# EAGLE design ssm (EAGLE 8.3.1)
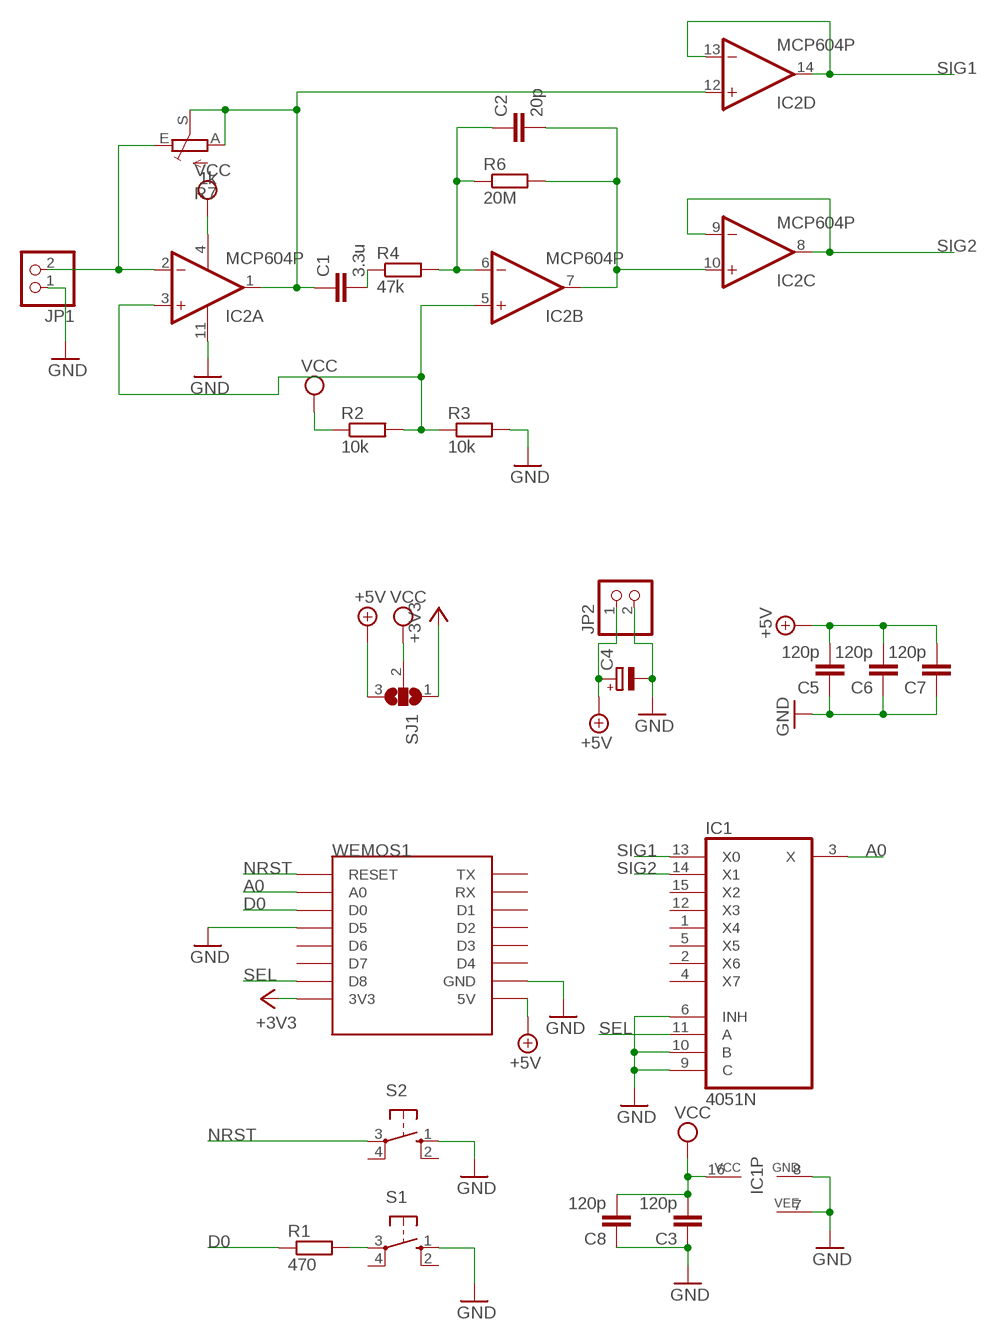
[diagram p0: schematic, sheet 1]

## Parts
C1  3.3u  C-EU  [C225-087X210]
C2  20p  C-EU025-024X044  [C025-024X044]
C3  120p  C-EU025-024X044  [C025-024X044]
C4  CPOL-EUE2.5-5  [E2,5-5]
C5  120p  C-EU025-024X044  [C025-024X044]
C6  120p  C-EU025-024X044  [C025-024X044]
C7  120p  C-EU025-024X044  [C025-024X044]
C8  120p  C-EU025-024X044  [C025-024X044]
IC1  4051N  [DIL16]
IC2  MCP604P  [DIL14]
JP1  PINHD-1X2  [1X02]
JP2  PINHD-1X2  [1X02]
R1  470  R-EU_0204/7  [0204/7]
R2  10k  R-EU_0204/7  [0204/7]
R3  10k  R-EU_0204/7  [0204/7]
R4  47k  R-EU_0204/7  [0204/7]
R6  20M  R-EU_0207/10  [0207/10]
R7  1k  TRIM_EU-B64Y  [B64Y]
S1  10-XX  [B3F-10XX]
S2  10-XX  [B3F-10XX]
SJ1  SJ2W  [SJ_2]
WEMOS1  WEMOS-D1-MINI  [WEMOS-D1-MINI]

## Nets
+3V3: SJ1.1 WEMOS1.3V3
+5V: C4.+ C5.2 C6.2 C7.2 JP2.1 SJ1.3 WEMOS1.5V
A0: IC1.3(X) WEMOS1.A0
D0: R1.1 WEMOS1.D0
GND: C3.1 C4.- C5.1 C6.1 C7.1 C8.1 IC1.6(INH) IC1.7(VEE) IC1.8(GND) IC1.9(C) IC1.10(B) IC2.11(P:V-) JP1.1 JP2.2 R3.2 S1.1(S) S2.1(S) WEMOS1.D5 WEMOS1.GND
N$2: IC2.2(A:-IN) JP1.2 R7.E
N$3: R1.2 S1.3(P)
N$4: IC2.3(A:+IN) IC2.5(B:+IN) R2.2 R3.1
N$5: C1.1 IC2.1(A:OUT) IC2.12(D:+IN) R7.A R7.S
N$6: C1.2 R4.1
N$7: C2.1 IC2.6(B:-IN) R4.2 R6.1
N$8: C2.2 IC2.7(B:OUT) IC2.10(C:+IN) R6.2
NRST: S2.3(P) WEMOS1.RESET
SEL: IC1.11(A) WEMOS1.D8
SIG1: IC1.13(X0) IC2.13(D:-IN) IC2.14(D:OUT)
SIG2: IC1.14(X1) IC2.8(C:OUT) IC2.9(C:-IN)
VCC: C3.2 C8.2 IC1.16(VCC) IC2.4(P:V+) R2.1 SJ1.2
Unconnected: IC1.1(X4) IC1.2(X6) IC1.4(X7) IC1.5(X5) IC1.12(X3) IC1.15(X2) S1.2(S1) S1.4(P1) S2.2(S1) S2.4(P1) WEMOS1.D1 WEMOS1.D2 WEMOS1.D3 WEMOS1.D4 WEMOS1.D6 WEMOS1.D7 WEMOS1.RX WEMOS1.TX

## Library data of the parts
C1 = Cap:C-EU: CAPACITOR, European symbol
C2 C3 C5-C8 = rcl:C-EU: CAPACITOR, European symbol
C4 = rcl:CPOL-EU: POLARIZED CAPACITOR, European symbol
IC1 = 40xx:4051: 8-channel ANALOG MULTIPLEXER
IC2 = linear:MCP604: Quad Op Amp 2.7V to 6.0V Single Supply CMOS Source: http://ww1.microchip.com/downloads/en/DeviceDoc/21314g.pdf
JP1 JP2 = pinhead:PINHD-1X2: PIN HEADER
R1-R4 = resistor:R-EU_: RESISTOR, European symbol
R6 = rcl:R-EU_: RESISTOR, European symbol
R7 = pot:TRIM_EU-: POTENTIOMETER
S1 S2 = switch-omron:10-XX: OMRON SWITCH; MPN: B3F-1000; OC_FARNELL: 176432; OC_NEWARK: 36M3542
SJ1 = jumper:SJ2W: SMD solder JUMPER
WEMOS1 = esp8266modules:WEMOS-D1-MINI: WeMos.cc D1 mini ESP8266 module

## Net classes
0 default: clearance 0.205 mm

## Board
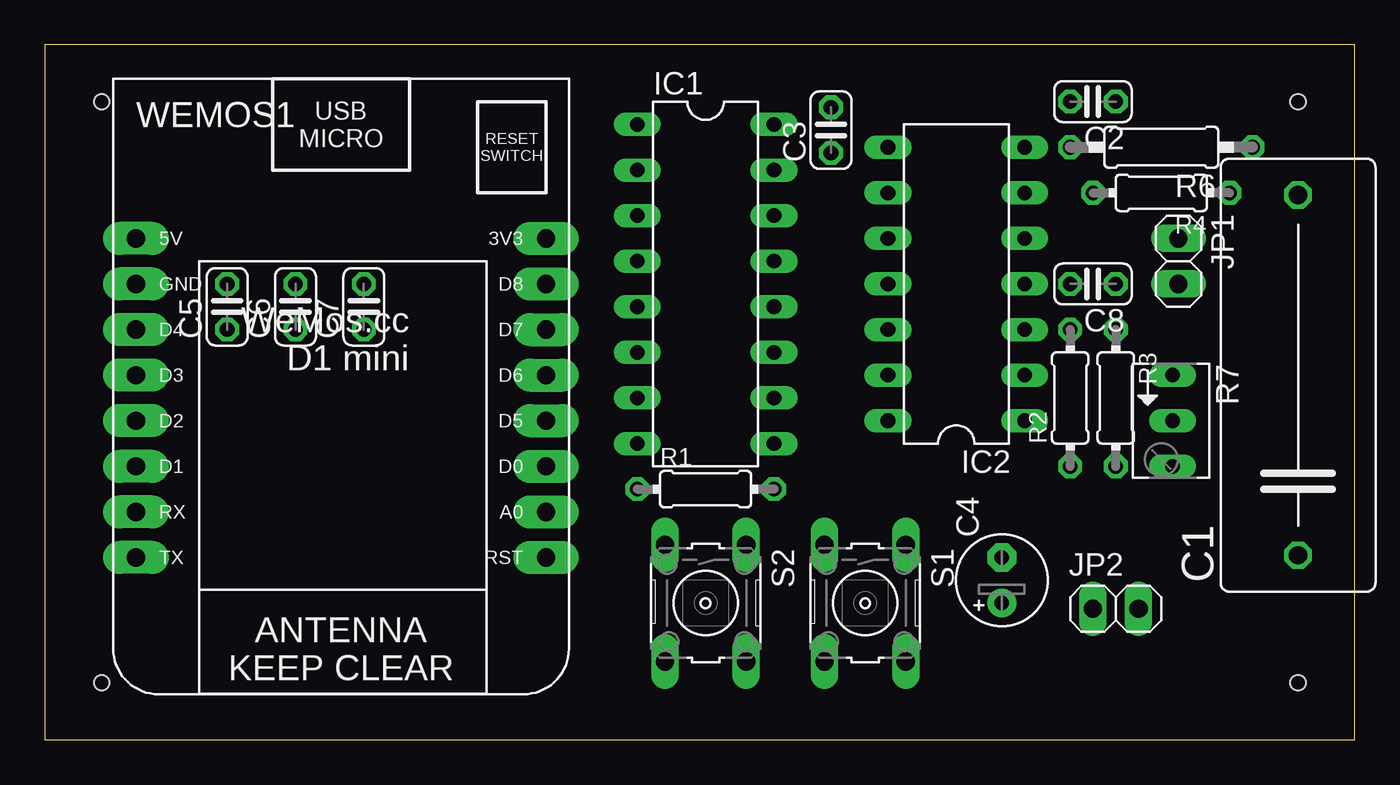
[diagram p1: board, top side]
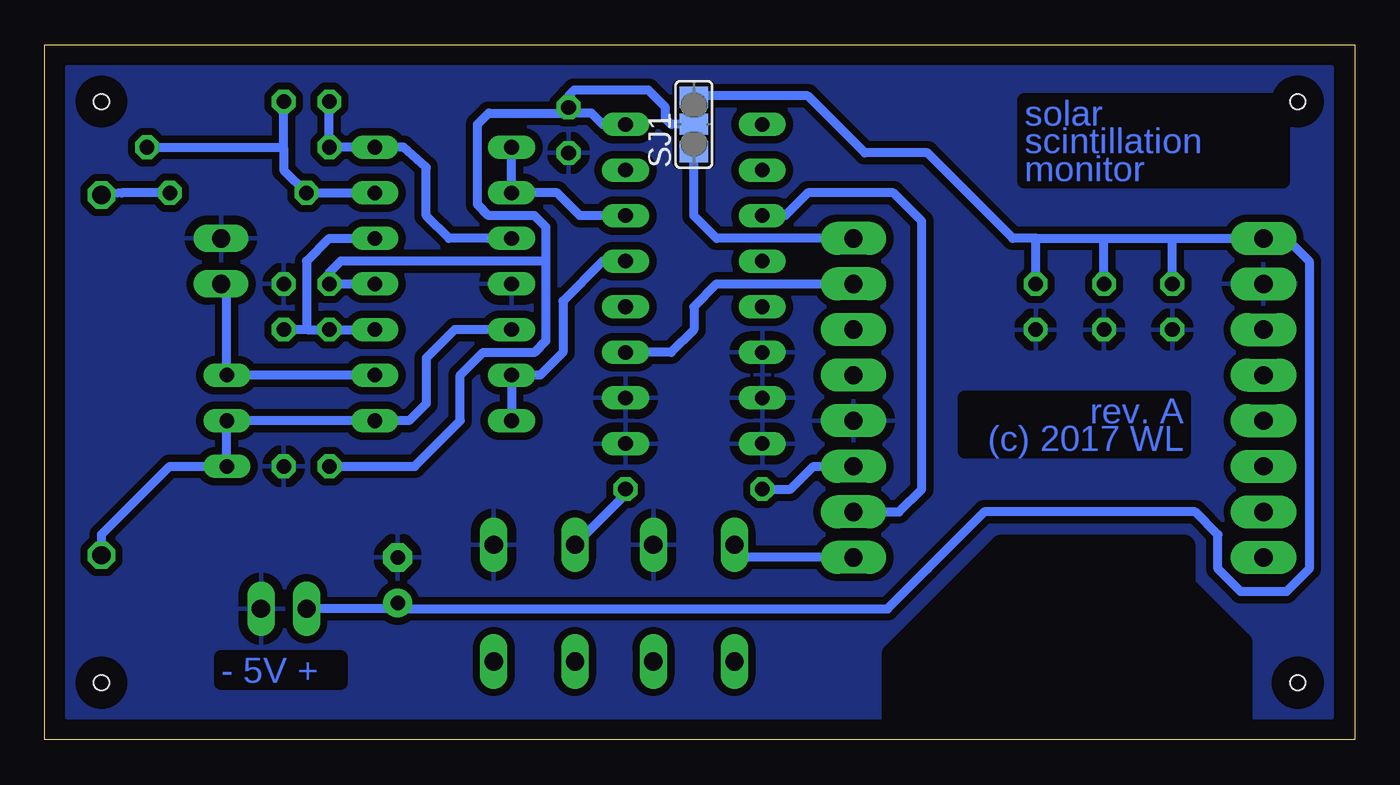
[diagram p2: board, bottom side, seen from below]

Size 73 x 38.72 mm. Coordinates in mm from the lower left corner, seen from the top.
Outline: 0,0 73,0 73,38.72 0,38.72 0,0
Copper layers (1*16): Top 0.035mm / dielectric 1.5mm / Bottom 0.035mm
Design rules "default *": minimum track width 6mil, minimum drill 0.35mm, track to track 6mil, track to pad 6mil, pad to pad 6mil, via to via 6mil, smd to smd 6mil, copper to edge 40mil, drill to drill 6mil, minimum pad ring 10mil, minimum via ring 8mil, stop-mask expansion 4mil, vias tented up to drill 0mil, thermal gap 20mil
Holes 0.85 mm at 3.18,35.56 3.18,3.18 69.85,3.18 69.85,35.56
bRestrict: area 6.3,1.3 to 25.7,10.8; area 47.6,31.4 to 47.9,31.8

### Footprints (pad centres in the part's own frame; a part is rotated, then mirrored left to right if it is on the bottom)
C225-087X210 = drill 1.016 octagon: 1 -11.303,0; 2 8.763,0
C025-024X044 = drill 0.813 octagon: 1 -1.27,0; 2 1.27,0
E2,5-5 = drill 0.813 pad 1.6: + -1.27,0 | drill 0.813 pad 1.6 octagon: - 1.27,0
DIL16 = drill 0.813 long: 1 -8.89,-3.81; 2 -6.35,-3.81; 3 -3.81,-3.81; 4 -1.27,-3.81; 5 1.27,-3.81; 6 3.81,-3.81; 7 6.35,-3.81; 8 8.89,-3.81; 9 8.89,3.81; 10 6.35,3.81; 11 3.81,3.81; 12 1.27,3.81; 13 -1.27,3.81; 14 -3.81,3.81; 15 -6.35,3.81; 16 -8.89,3.81
DIL14 = drill 0.813 long: 1 -7.62,-3.81; 2 -5.08,-3.81; 3 -2.54,-3.81; 4 0,-3.81; 5 2.54,-3.81; 6 5.08,-3.81; 7 7.62,-3.81; 8 7.62,3.81; 9 5.08,3.81; 10 2.54,3.81; 11 0,3.81; 12 -2.54,3.81; 13 -5.08,3.81; 14 -7.62,3.81
1X02 = drill 1.016 long: 1 -1.27,0; 2 1.27,0
0204/7 = drill 0.813 octagon: 1 -3.81,0; 2 3.81,0
0207/10 = drill 0.813 octagon: 1 -5.08,0; 2 5.08,0
B64Y = drill 0.813 long: A 2.54,0; E -2.54,0; S 0,0
B3F-10XX = drill 1.016 long: 1 -3.251,2.261; 2 3.251,2.261; 3 -3.251,-2.261; 4 3.251,-2.261
SJ_2 = smd 1.168 x 1.6: 1 -1.524,0; 2 0,0; 3 1.524,0
WEMOS-D1-MINI = drill 1.016 pad 1.829 long: 3V3 -10.16,-10.16; 5V 12.7,-10.16; A0 -10.16,5.08; D0 -10.16,2.54; D1 12.7,2.54; D2 12.7,0; D3 12.7,-2.54; D4 12.7,-5.08; D5 -10.16,0; D6 -10.16,-2.54; D7 -10.16,-5.08; D8 -10.16,-7.62; GND 12.7,-7.62; RESET -10.16,7.62; RX 12.7,5.08; TX 12.7,7.62

### Placement (x,y rotation side)
C1  69.85,21.59 90 top
C2  58.42,35.56 180 top
C3  43.81,33.97 90 top
C4  53.34,8.89 90 top
C5  10.16,24.13 90 top
C6  13.97,24.13 90 top
C7  17.78,24.13 90 top
C8  58.42,25.4 180 top
IC1  36.83,25.4 270 top
IC2  50.8,25.4 90 top
JP1  63.18,26.67 270 top
JP2  59.69,7.3 0 top
R1  36.83,13.97 0 top
R2  57.15,19.05 90 top
R3  59.69,19.05 270 top
R4  62.23,30.48 180 top
R6  62.23,33.02 180 top
R7  62.86,17.78 270 top
S1  45.72,7.62 270 top
S2  36.83,7.62 270 top
SJ1  36.83,34.29 90 bottom
WEMOS1  17.78,17.78 180 top

### Tracks (layer width: path | path; a pad name or v marks a point on that pad's centre or on a via)
+3V3
  Bottom 0.508: WEMOS1.3V3 35.56,27.94 36.83,29.21 SJ1.1
+5V
  Bottom 0.508: 53.34,7.3 JP2.1 | 53.34,7.3 26.04,7.3 23.81,9.53 21.91,11.43 20.64,12.7 8.89,12.7 7.62,11.43 7.62,9.52 6.35,8.26 3.81,8.26 2.54,9.52 2.54,26.67 3.81,27.94 WEMOS1.5V 10.18,27.94 | C4.+ 53.34,7.31 53.34,7.3 | 14,27.94 10.18,27.94 | 17.71,27.94 14,27.94 | 17.71,27.94 19.05,27.94 23.81,32.7 27.3,32.7 30.48,35.88 36.77,35.88 SJ1.3 | C5.2 10.16,27.92 10.18,27.94 | C6.2 13.97,27.91 14,27.94 | C7.2 17.78,27.87 17.71,27.94
A0
  Bottom 0.508: WEMOS1.A0 25.4,12.7 24.13,13.97 24.13,28.89 25.72,30.48 30.48,30.48 31.75,29.21 IC1.3
D0
  Bottom 0.508: R1.1 31.43,13.97 30.16,15.24 WEMOS1.D0
GND
  pour Bottom (isolate 0.406): 1.27,37.47 1.27,1.27 71.75,1.27 71.75,37.47
N$2
  Bottom 0.508: 63.5,25.4 JP1.2 62.86,25.08 R7.E IC2.2
N$3
  Bottom 0.508: R1.2 40.64,13.69 S1.3
N$4
  Bottom 0.508: IC2.5 57.15,27.94 58.42,26.67 58.42,22.9 58.38,22.86 | IC2.3 R2.2 58.38,22.86 | 58.38,22.86 R3.1
N$5
  Bottom 0.508: C1.1 69.85,11.43 66.04,15.24 R7.A R7.S IC2.1 52.7,17.78 51.75,18.73 51.75,21.27 50.16,22.86 IC2.12
N$6
  Bottom 0.508: R4.1 68.71,30.48 C1.2
N$7
  Bottom 0.508: IC2.6 R4.2 59.69,31.75 59.69,32.92 | 59.69,32.92 C2.1 | R6.1 59.79,33.02 59.69,32.92
N$8
  Bottom 0.508: 55.88,33.02 IC2.7 | 48.26,27.94 IC2.10 50.48,27.94 51.75,29.21 51.75,31.89 53.02,33.02 IC2.7 | IC2.7 R6.2 C2.2
NRST
  Bottom 0.508: WEMOS1.RESET 33.86,10.16 S2.3
SEL
  Bottom 0.508: IC1.11 38.1,21.59 36.83,22.86 36.83,24.13 35.56,25.4 WEMOS1.D8
SIG1
  Bottom 0.508: IC2.14 IC2.13 45.4,20.32 44.13,21.59 44.13,24.45 41.91,26.67 IC1.13
SIG2
  Bottom 0.508: IC1.14 43.18,29.21 44.45,30.48 IC2.9 IC2.8
VCC
  Bottom 0.508: 45.08,26.67 45.08,28.58 45.72,29.21 48.26,29.21 48.89,29.84 48.89,34.29 48.26,34.93 44.13,34.93 43.9,35.16 | 45.08,26.67 45.08,22.23 45.72,21.59 48.58,21.59 49.85,20.32 49.85,17.78 52.39,15.24 R2.1 | 57.07,25.4 IC2.4 | 57.07,25.4 C8.2 | SJ1.2 38.1,34.29 38.42,34.61 38.42,35.24 39.37,36.2 43.5,36.2 43.81,35.88 C3.2 43.9,35.16 | IC1.16 41.91,34.29 42.55,34.93 43.66,34.93 43.9,35.16 | 57.07,25.4 57.15,25.48 57.15,26.04 56.52,26.67 45.08,26.67

### Text on the board
Bottom: solar / scintillation / monitor | rev. A / (c) 2017 WL | - 5V +